# EAGLE schematic 2_port (EAGLE 7.2.0)
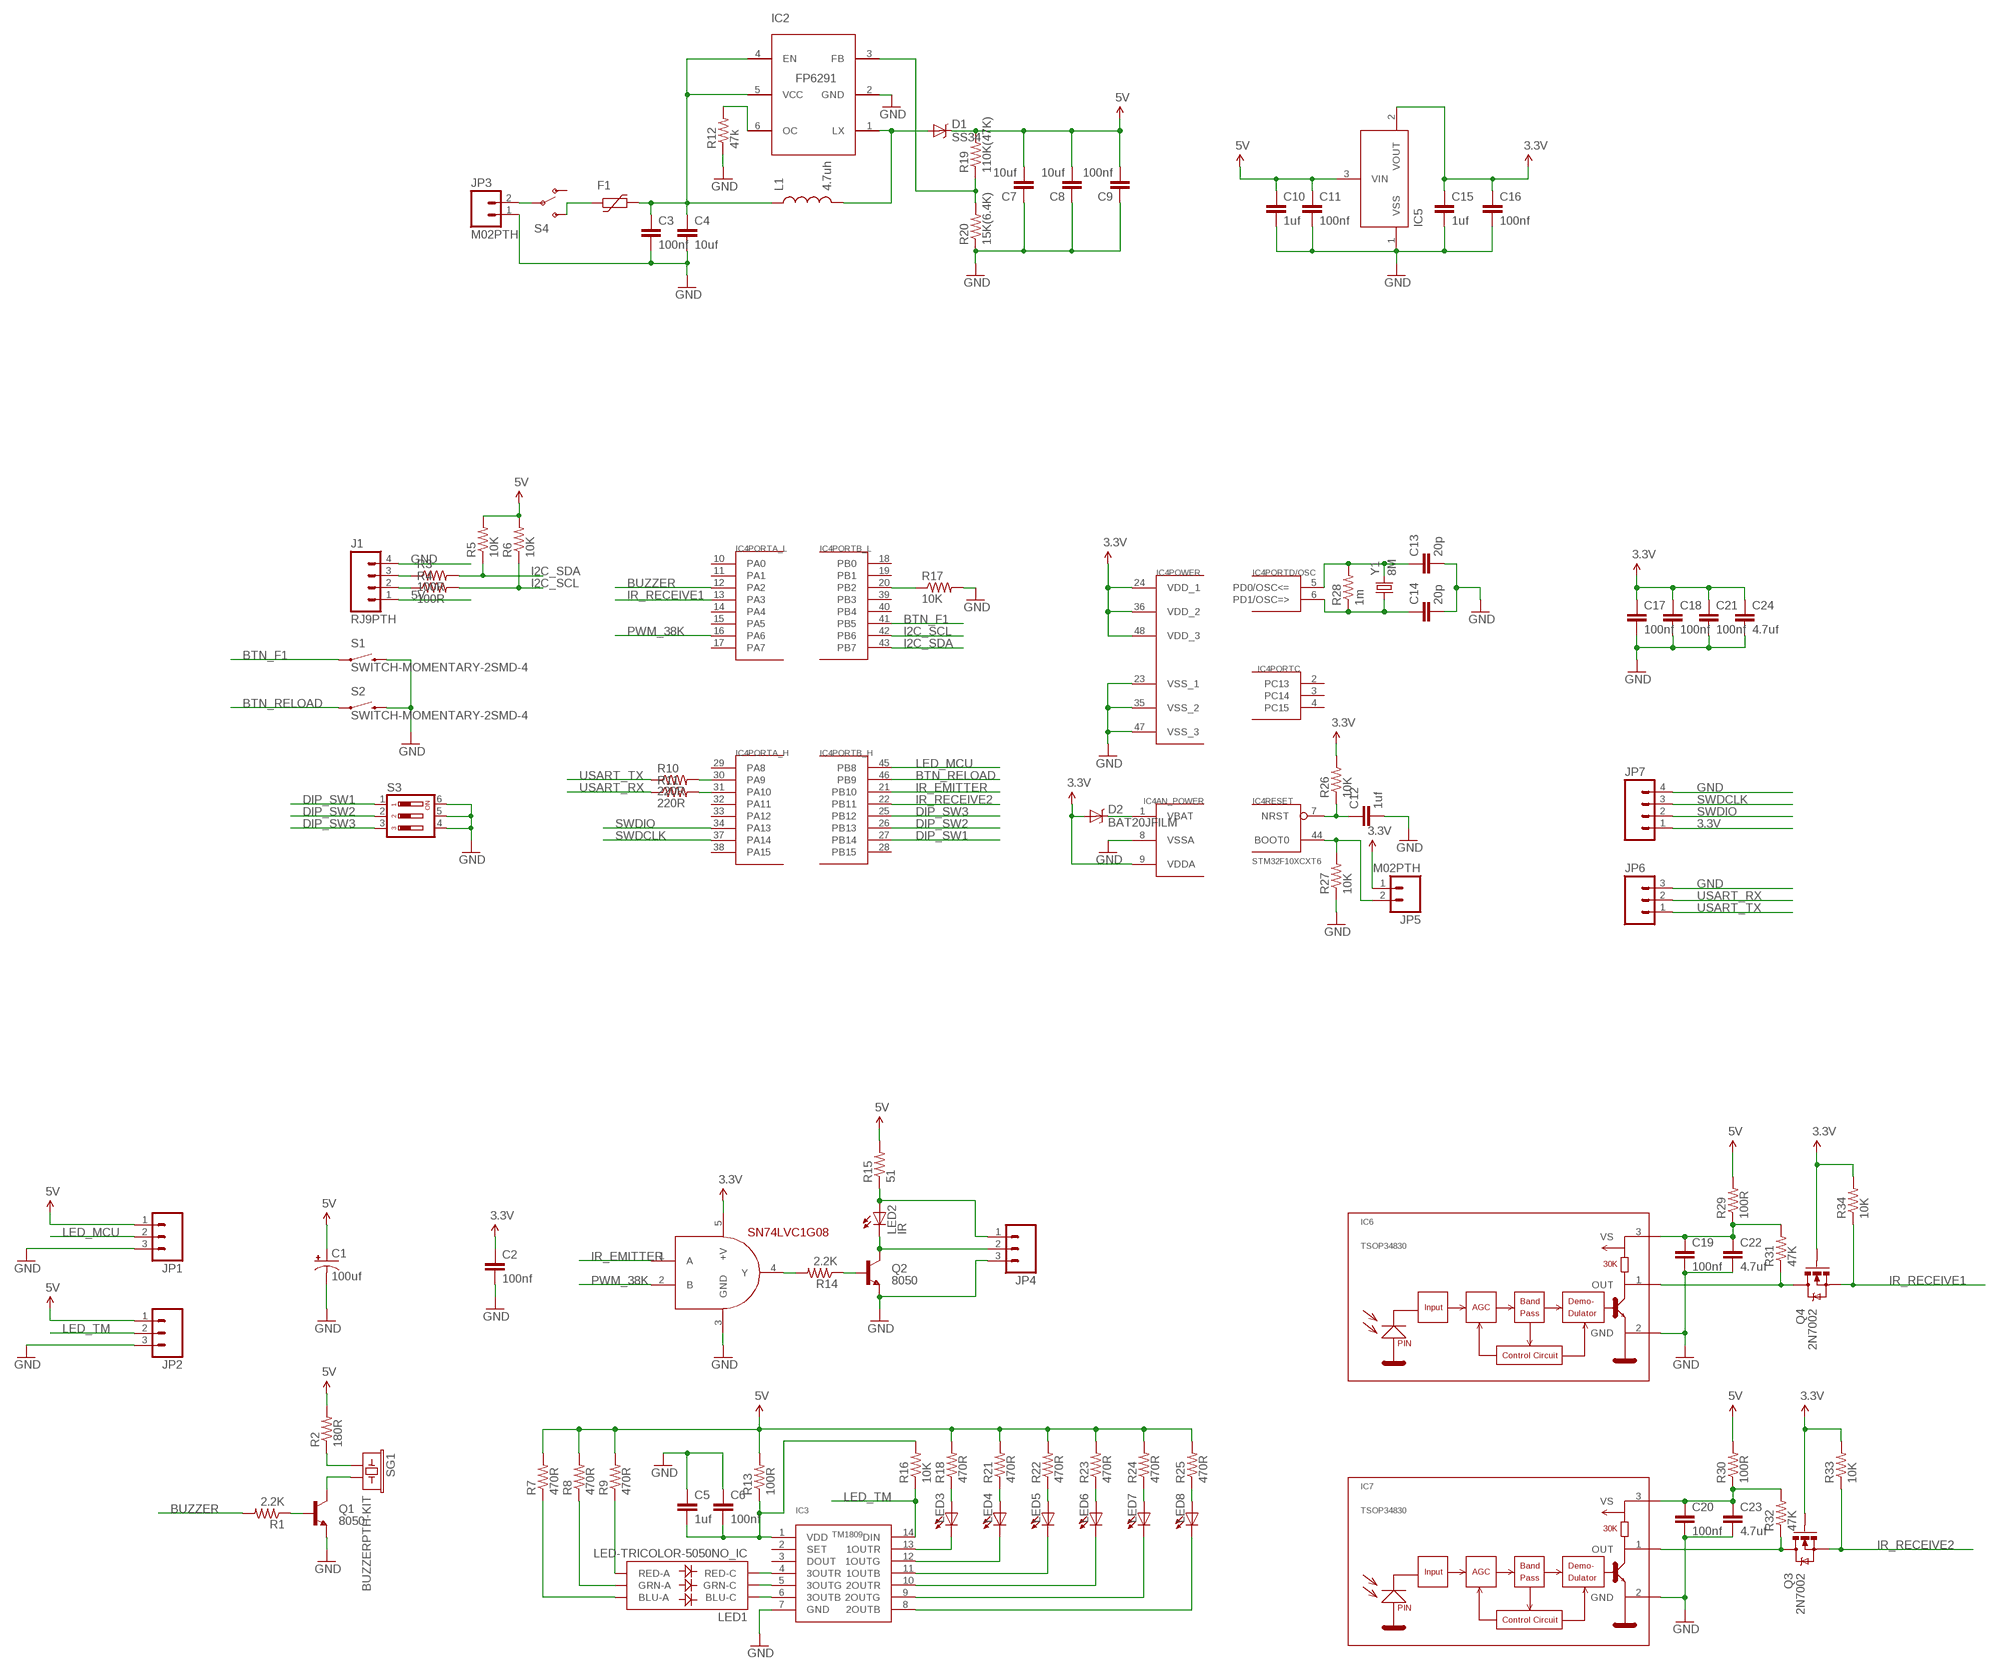
[diagram p0: schematic, sheet 1]

## Parts
C1  100uf  CAP_POL6032  [EIA6032]
C2  100nf  CAP0603-CAP  [0603-CAP]
C3  100nf  CAP0603-CAP  [0603-CAP]
C4  10uf  CAP0603-CAP  [0603-CAP]
C5  1uf  CAP0603-CAP  [0603-CAP]
C6  100nf  CAP0603-CAP  [0603-CAP]
C7  10uf  CAP0603-CAP  [0603-CAP]
C8  10uf  CAP0603-CAP  [0603-CAP]
C9  100nf  CAP0603-CAP  [0603-CAP]
C10  1uf  CAP0603-CAP  [0603-CAP]
C11  100nf  CAP0603-CAP  [0603-CAP]
C12  1uf  CAP0603-CAP  [0603-CAP]
C13  20p  CAP0603-CAP  [0603-CAP]
C14  20p  CAP0603-CAP  [0603-CAP]
C15  1uf  CAP0603-CAP  [0603-CAP]
C16  100nf  CAP0603-CAP  [0603-CAP]
C17  100nf  CAP0603-CAP  [0603-CAP]
C18  100nf  CAP0603-CAP  [0603-CAP]
C19  100nf  CAP0603-CAP  [0603-CAP]
C20  100nf  CAP0603-CAP  [0603-CAP]
C21  100nf  CAP0603-CAP  [0603-CAP]
C22  4.7uf  CAP0603-CAP  [0603-CAP]
C23  4.7uf  CAP0603-CAP  [0603-CAP]
C24  4.7uf  CAP0603-CAP  [0603-CAP]
D1  SS34  DIODE-SCHOTTKY_  [SMA-DIODE]
D2  BAT20JFILM  [SOD-323]
F1  PTC-FUSE  [R0805]
IC1  SN74LVC1G08  [SOT23-5]
IC2  FP6291  [SOT23-6]
IC3  TM1809  [SOP-14]
IC4  STM32F10XCXT6  [TQFP48]
IC5  XC6206  [SOT23-3]
IC6  TSOP34830  [TSOP348]
IC7  TSOP34830  [TSOP348]
J1  RJ9PTH  [RJ9]
JP1  M03PTH  [1X03]
JP2  M03PTH  [1X03]
JP3  M02PTH  [1X02]
JP4  M03PTH  [1X03]
JP5  M02PTH  [1X02]
JP6  M03PTH  [1X03]
JP7  M04PTH  [1X04]
L1  4.7uh  INDUCTORCR75_V2  [CR75_V2]
LED1  LED-TRICOLOR-5050NO_IC  [LED-TRICOLOR-5050]
LED2  IR  LED5MM  [LED5MM]
LED3  LED0805  [CHIPLED_0805]
LED4  LED0805  [CHIPLED_0805]
LED5  LED0805  [CHIPLED_0805]
LED6  LED0805  [CHIPLED_0805]
LED7  LED0805  [CHIPLED_0805]
LED8  LED0805  [CHIPLED_0805]
Q1  8050  TRANSISTOR_NPNSOT23  [SOT23]
Q2  8050  TRANSISTOR_NPNSOT23  [SOT23]
Q3  2N7002  MOSFET-NCHANNELBSS138  [SOT23]
Q4  2N7002  MOSFET-NCHANNELBSS138  [SOT23]
R1  2.2K  RESISTOR0603-RES  [0603-RES]
R2  180R  RESISTOR0603-RES  [0603-RES]
R3  100R  RESISTOR0603-RES  [0603-RES]
R4  100R  RESISTOR0603-RES  [0603-RES]
R5  10K  RESISTOR0603-RES  [0603-RES]
R6  10K  RESISTOR0603-RES  [0603-RES]
R7  470R  RESISTOR0603-RES  [0603-RES]
R8  470R  RESISTOR0603-RES  [0603-RES]
R9  470R  RESISTOR0603-RES  [0603-RES]
R10  220R  RESISTOR0603-RES  [0603-RES]
R11  220R  RESISTOR0603-RES  [0603-RES]
R12  47k  RESISTOR0603-RES  [0603-RES]
R13  100R  RESISTOR0603-RES  [0603-RES]
R14  2.2K  RESISTOR0603-RES  [0603-RES]
R15  51  RESISTOR1206  [1206]
R16  10K  RESISTOR0603-RES  [0603-RES]
R17  10K  RESISTOR0603-RES  [0603-RES]
R18  470R  RESISTOR0603-RES  [0603-RES]
R19  110K(47K)  RESISTOR0603-RES  [0603-RES]
R20  15K(6.4K)  RESISTOR0603-RES  [0603-RES]
R21  470R  RESISTOR0603-RES  [0603-RES]
R22  470R  RESISTOR0603-RES  [0603-RES]
R23  470R  RESISTOR0603-RES  [0603-RES]
R24  470R  RESISTOR0603-RES  [0603-RES]
R25  470R  RESISTOR0603-RES  [0603-RES]
R26  10K  RESISTOR0603-RES  [0603-RES]
R27  10K  RESISTOR0603-RES  [0603-RES]
R28  1m  RESISTOR0603-RES  [0603-RES]
R29  100R  RESISTOR0603-RES  [0603-RES]
R30  100R  RESISTOR0603-RES  [0603-RES]
R31  47K  RESISTOR0603-RES  [0603-RES]
R32  47K  RESISTOR0603-RES  [0603-RES]
R33  10K  RESISTOR0603-RES  [0603-RES]
R34  10K  RESISTOR0603-RES  [0603-RES]
S1  SWITCH-MOMENTARY-2SMD-4  [TACTILE_SWITCH_TALL]
S2  SWITCH-MOMENTARY-2SMD-4  [TACTILE_SWITCH_TALL]
S3  DIP03YL  [DIP03YL]
S4  SWITCH-SPST3AM6  [SWITCH-SPDT-AM#6]
SG1  BUZZERPTH-KIT  [BUZZER-12MM-KIT]
Y1  8M  CRYSTALTXC-7A  [CRYSTAL-TXC-7A]

## Nets
3.3V: C2.1 C15.1 C16.1 C17.1 C18.1 C21.1 C24.1 D2.2(A) IC1.5(+V) IC4.9(AN_POWER:VDDA) IC4.24(POWER:VDD_1) IC4.36(POWER:VDD_2) IC4.48(POWER:VDD_3) IC5.2(VOUT) JP5.1 JP7.1 Q3.1(G) Q4.1(G) R26.2 R33.2 R34.2
5V: C1.P$1(+) C7.2 C8.2 C9.2 C10.1 C11.1 D1.C IC5.3(VIN) J1.1 JP1.1 JP2.1 R2.2 R5.2 R6.2 R7.2 R8.2 R9.2 R13.2 R15.2 R18.2 R19.2 R21.2 R22.2 R23.2 R24.2 R25.2 R29.2 R30.2
BTN_F1: IC4.41(PORTB_L:PB5) S1.A2
BTN_RELOAD: IC4.46(PORTB_H:PB9) S2.A2
BUZZER: IC4.12(PORTA_L:PA2) R1.2
DIP_SW1: IC4.27(PORTB_H:PB14) S3.1
DIP_SW2: IC4.26(PORTB_H:PB13) S3.2
DIP_SW3: IC4.25(PORTB_H:PB12) S3.3
GND: C1.P$2(-) C2.2 C3.2 C4.2 C5.1 C6.1 C7.1 C8.1 C9.1 C10.2 C11.2 C12.2 C13.2 C14.2 C15.2 C16.2 C17.2 C18.2 C19.2 C20.2 C21.2 C22.2 C23.2 C24.2 IC1.3(GND) IC2.2(GND) IC3.7(GND) IC4.8(AN_POWER:VSSA) IC4.23(POWER:VSS_1) IC4.35(POWER:VSS_2) IC4.47(POWER:VSS_3) IC5.1(VSS) IC6.2(GND) IC7.2(GND) J1.4 JP1.3 JP2.3 JP3.1 JP4.3 JP6.3 JP7.4 Q1.2(E) Q2.2(E) R12.1 R17.2 R20.1 R27.1 S1.B2 S2.B2 S3.4 S3.5 S3.6
I2C_SCL: IC4.42(PORTB_L:PB6) R4.2 R6.1
I2C_SDA: IC4.43(PORTB_L:PB7) R3.2 R5.1
IR_EMITTER: IC1.1(A) IC4.21(PORTB_H:PB10)
IR_RECEIVE1: IC4.13(PORTA_L:PA3) Q4.2(S) R34.1
IR_RECEIVE2: IC4.22(PORTB_H:PB11) Q3.2(S) R33.1
LED_MCU: IC4.45(PORTB_H:PB8) JP1.2
LED_TM: IC3.14(DIN) JP2.2 R16.1
N$1: IC4.20(PORTB_L:PB2) R17.1
N$2: IC4.44(RESET:BOOT0) JP5.2 R27.2
N$3: C13.1 IC4.5(PORTD/OSC:PD0/OSC<=) R28.2 Y1.P$2
N$4: C14.1 IC4.6(PORTD/OSC:PD1/OSC=>) R28.1 Y1.P$1
N$5: D2.1(C) IC4.1(AN_POWER:VBAT)
N$6: IC1.4(Y) R14.2
N$7: JP3.2 S4.2(P)
N$8: JP4.2 LED2.K(C) Q2.3(C)
N$9: Q2.1(B) R14.1
N$10: F1.1 S4.3(S)
N$11: C19.1 C22.1 IC6.3(VS) R29.1 R31.2
N$12: C20.1 C23.1 IC7.3(VS) R30.1 R32.2
N$13: IC3.4(3OUTR) LED1.5(RED-C)
N$14: JP4.1 LED2.A R15.1
N$15: IC3.5(3OUTG) LED1.6(GRN-C)
N$16: IC3.6(3OUTB) LED1.4(BLU-C)
N$17: LED1.2(RED-A) R9.1
N$18: LED1.1(GRN-A) R8.1
N$19: LED1.3(BLU-A) R7.1
N$20: C3.1 C4.1 F1.2 IC2.4(EN) IC2.5(VCC) L1.P$1
N$21: IC3.13(1OUTR) LED3.C
N$22: D1.A IC2.1(LX) L1.P$2
N$23: IC2.6(OC) R12.2
N$24: LED3.A R18.1
N$25: IC2.3(FB) R19.1 R20.2
N$26: LED4.A R21.1
N$27: IC3.12(1OUTG) LED4.C
N$28: IC3.11(1OUTB) LED5.C
N$29: IC3.10(2OUTR) LED6.C
N$30: IC3.9(2OUTG) LED7.C
N$31: IC3.8(2OUTB) LED8.C
N$32: LED5.A R22.1
N$33: LED6.A R23.1
N$34: LED7.A R24.1
N$35: LED8.A R25.1
N$36: C5.2 C6.2 IC3.1(VDD) R13.1 R16.2
N$37: IC4.30(PORTA_H:PA9) R10.2
N$38: IC4.31(PORTA_H:PA10) R11.2
N$39: J1.3 R3.1
N$40: J1.2 R4.1
N$41: R2.1 SG1.+
N$42: Q1.3(C) SG1.-
N$43: Q1.1(B) R1.1
N$44: C12.1 IC4.7(RESET:NRST) R26.1
N$45: IC6.1(OUT) Q4.3(D) R31.1
N$47: IC7.1(OUT) Q3.3(D) R32.1
PWM_38K: IC1.2(B) IC4.16(PORTA_L:PA6)
SWDCLK: IC4.37(PORTA_H:PA14) JP7.3
SWDIO: IC4.34(PORTA_H:PA13) JP7.2
USART_RX: JP6.2 R11.1
USART_TX: JP6.1 R10.1
Unconnected: IC3.2(SET) IC3.3(DOUT) IC4.2(PORTC:PC13) IC4.3(PORTC:PC14) IC4.4(PORTC:PC15) IC4.10(PORTA_L:PA0) IC4.11(PORTA_L:PA1) IC4.14(PORTA_L:PA4) IC4.15(PORTA_L:PA5) IC4.17(PORTA_L:PA7) IC4.18(PORTB_L:PB0) IC4.19(PORTB_L:PB1) IC4.28(PORTB_H:PB15) IC4.29(PORTA_H:PA8) IC4.32(PORTA_H:PA11) IC4.33(PORTA_H:PA12) IC4.38(PORTA_H:PA15) IC4.39(PORTB_L:PB3) IC4.40(PORTB_L:PB4) S4.1(O)

## Library data of the parts
C1 = SparkFun-Capacitors:CAP_POL: Capacitor Polarized These are standard SMD and PTH capacitors. Normally 10uF, 47uF, and 100uF in electrolytic and tantalum varieties. Always verify the external diameter of the through hole cap, it varies with capacity, voltage, and manufacturer. The EIA devices should be standard.
C2-C24 = SparkFun-Passives:CAP: Capacitor Standard 0603 ceramic capacitor, and 0.1" leaded capacitor.
D1 = SparkFun-DiscreteSemi:DIODE-SCHOTTKY: Commonly MBRA140.
D2 = SparkFun-DiscreteSemi:BAT20JFILM: 23V, 1A Schottky diode, SOD-323 package; PROD_ID: DIO-11623
F1 = digital-toy:PTC-FUSE
IC1 = SparkFun-DigitalIC:SN74LVC1G08: Single-gate AND logic
IC2 = eagle_lib_lishen:FP6291
IC3 = eagle_lib_lishen:TM1809
IC4 = stm32:STM32F10XCXT6: ST STM32F101/103 48pin LQFP
IC5 = SparkFun-PowerIC:XC6206: Low ESR Cap. Compatible Positive Voltage Regulator
IC6 IC7 = vishay-1:TSOP348*: IR Receiver Modules for Remote Control Systems http://www.vishay.com/ir-receiver-modules/
J1 = SparkFun-Connectors:RJ9: RJ9 connector (e.g., phone handsets)
JP1 JP2 JP4 JP6 = SparkFun-Connectors:M03: Header 3 Standard 3-pin 0.1" header. Use with straight break away headers (SKU : PRT-00116), right angle break away headers (PRT-00553), swiss pins (PRT-00743), machine pins (PRT-00117), and female headers (PRT-00115). Molex polarized connector foot print use with SKU : PRT-08232 with associated crimp pins and housings.
JP3 JP5 = SparkFun-Connectors:M02: Standard 2-pin 0.1" header. Use with - straight break away headers ( PRT-00116) - right angle break away headers (PRT-00553) - swiss pins (PRT-00743) - machine pins (PRT-00117) - female headers (PRT-00115) Molex polarized connector foot print use with: PRT-08233 with associated crimp pins and housings. 2.54_SCREWTERM for use with PRT-10571. 3.5mm Screw Terminal footprints for PRT-08084 5mm Screw Terminal footprints for use with PRT-08433
JP7 = SparkFun-Connectors:M04: Header 4 Standard 4-pin 0.1" header. Use with straight break away headers (SKU : PRT-00116), right angle break away headers (PRT-00553), swiss pins (PRT-00743), machine pins (PRT-00117), and female headers (PRT-00115). Molex polarized connector foot print use with SKU : PRT-08231 with associated crimp pins and housings. 1MM SMD Version SKU: PRT-10208
L1 = SparkFun-Passives:INDUCTOR: Inductors Basic Inductor/Choke - 0603 and 1206. Footprints are not proven and vary greatly between part numbers. SRN6045- 33uH, 20% 1.4A SDR0403-560KL - 56uH, 10%, 500mA RMS/740mA peak
LED1 = SparkFun-LED:LED-TRICOLOR-5050
LED2 = SparkFun-LED:LED: LEDs
LED3-LED8 = digital-toy:LED: LEDs
Q1 Q2 = SparkFun-DiscreteSemi:TRANSISTOR_NPN: Generic NPN BJT MMBT2222A - TRANS-08049 (SOT-23, 1A 40V) MPSA42 - TRANS-09116 (SOT-23, 500mA 300V) MMBT5088LT1G - TRANS-11160 (SOT-23, 50 mA 30V)
Q3 Q4 = SparkFun-DiscreteSemi:MOSFET-NCHANNEL: Common NMOSFET Parts MFG P/N Store ID Prod ID FDD8780 TRANS-09984 SI7820DN TRANS-11055 FDS6630A IC-08089 2N7002PW TRANS-11151 FQP30N06L COM-10213 TRANS-10060 BSS123LT1G TRANS-08345 BSS138 TRANS-00830 BS170 2N7000; PROD_ID: TRANS-00830
R1-R14 R16-R34 = SparkFun-Passives:RESISTOR: Resistor Basic schematic elements and footprints for 0603, 1206, and PTH resistors.
R15 = SparkFun-Resistors:RESISTOR: Resistor Basic schematic elements and footprints for 0603, 1206, and PTH resistors.
S1 S2 = SparkFun-Electromechanical:SWITCH-MOMENTARY-2: Various NO switches- pushbuttons, reed, etc
S3 = switch-dil:DIP03YL: DIL/CODE SWITCH; OC_FARNELL: unknown; OC_NEWARK: unknown
S4 = digital-toy:SWITCH-SPST: SPST Switch Simple slide switch. Spark Fun Electronics SKU : COM-00102
SG1 = SparkFun-Electromechanical:BUZZER: Buzzer 12mm Spark Fun Electronics SKU : Comp-Buzzer; PROD_ID: COMP-08253
Y1 = SparkFun-FreqCtrl:CRYSTAL: Various standard crystals. Proven footprints. Spark Fun Electronics SKU : COM-00534